# EAGLE design plat_40pinControlSimple (EAGLE 5.11)
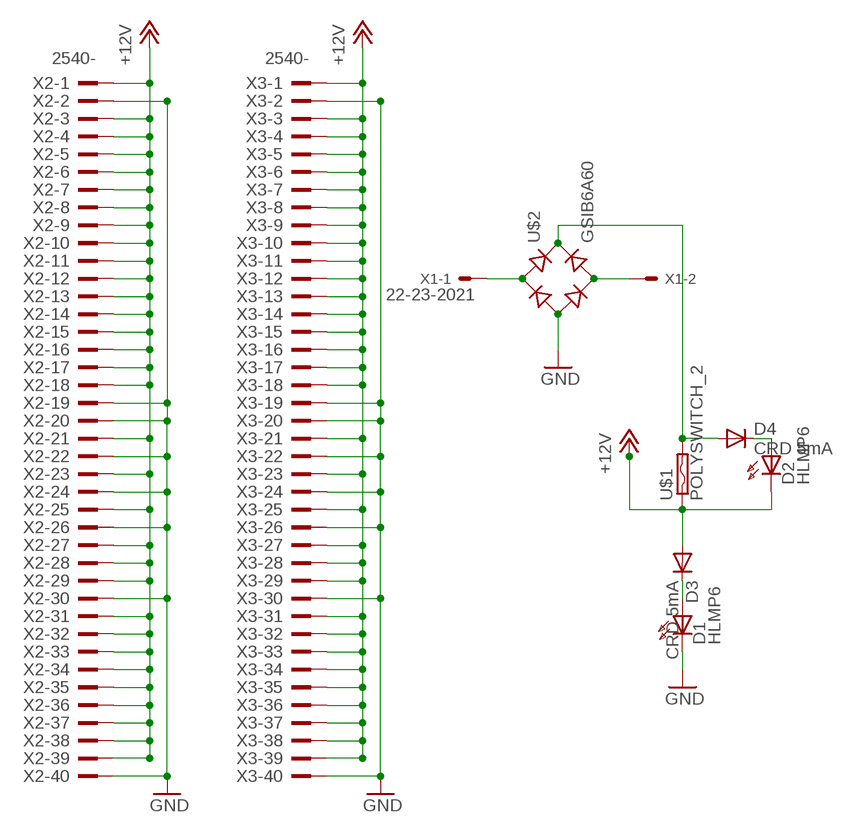
[diagram p0: schematic, sheet 1]

## Parts
D1  HLMP6  [HLMP6]
D2  HLMP6  [HLMP6]
D3  CRD 5mA  1N4148DO35-7  [DO35-7]
D4  CRD 5mA  1N4148DO35-7  [DO35-7]
U$1  POLYSWITCH_2  [0204/5]
U$2  GSIB6A60  [GSIB6A60]
X1  22-23-2021  [22-23-2021]
X2  2540-  [PAK100/2500-40]
X3  2540-  [PAK100/2500-40]

## Nets
+12V: D2.K D3.A U$1.1 X2.1 X2.3 X2.4 X2.5 X2.6 X2.7 X2.8 X2.9 X2.10 X2.11 X2.12 X2.13 X2.14 X2.15 X2.16 X2.17 X2.18 X2.21 X2.23 X2.25 X2.27 X2.28 X2.29 X2.31 X2.32 X2.33 X2.34 X2.35 X2.36 X2.37 X2.38 X2.39 X3.1 X3.3 X3.4 X3.5 X3.6 X3.7 X3.8 X3.9 X3.10 X3.11 X3.12 X3.13 X3.14 X3.15 X3.16 X3.17 X3.18 X3.21 X3.23 X3.25 X3.27 X3.28 X3.29 X3.31 X3.32 X3.33 X3.34 X3.35 X3.36 X3.37 X3.38 X3.39
GND: D1.K U$2.P$4.-(-) X2.2 X2.19 X2.20 X2.22 X2.24 X2.26 X2.30 X2.40 X3.2 X3.19 X3.20 X3.22 X3.24 X3.26 X3.30 X3.40
N$1: D1.A D3.C
N$2: U$2.P$2.AC1(AC1) X1.1
N$3: D2.A D4.C
N$4: U$2.P$3.AC2(AC2) X1.2
N$9: D4.A U$1.2 U$2.P$1.+(+)

## Library data of the parts
D1 D2 = display-hp:HLMP6: LED 2mm horizontal; MF: AGILENT TECHNOLOGIES; MPN: HLMP-6500; OC_FARNELL: 1652490; OC_NEWARK: 40K0088
D3 D4 = diode:1N4148: DIODE high speed (Philips)
U$1 = myparts:POLYSWITCH_2
U$2 = myparts:GSIB6A60
X1 = con-molex:22-23-2021: .100" (2.54mm) Center Header - 2 Pin; MF: MOLEX; MPN: 22-23-2021; OC_FARNELL: 1462926; OC_NEWARK: 25C3832
X2 X3 = con-3m:2540-: 3M (TM) Pak 100 4-Wall Header Source: 3M; OC_FARNELL: unknown; OC_NEWARK: unknown

## Net classes
0 default: width 1.524 mm, drill 1.524 mm, clearance 1.016 mm

## Board
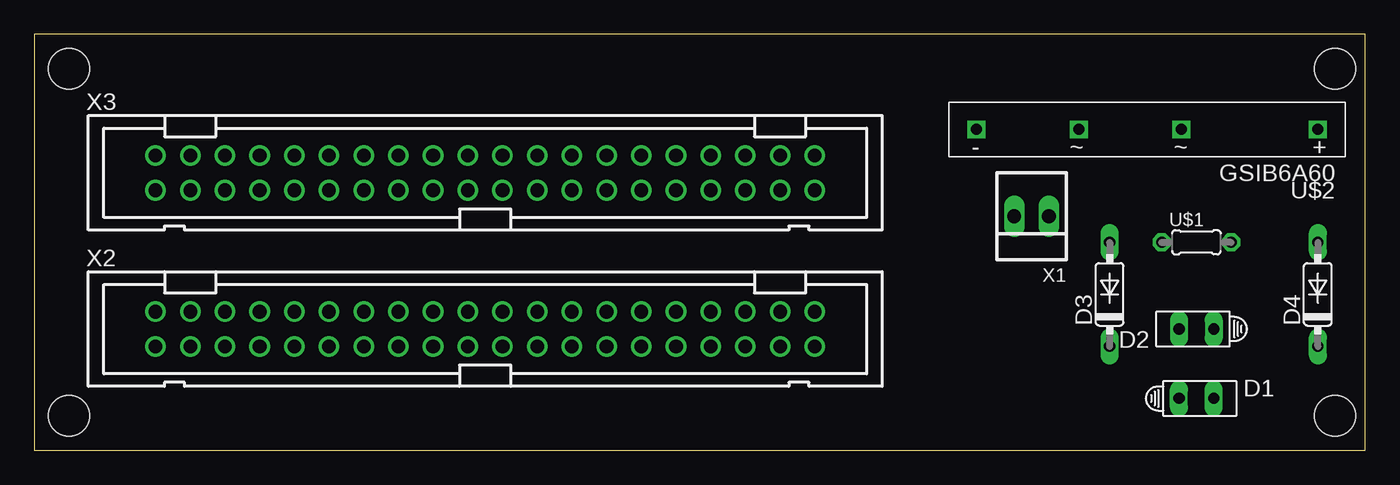
[diagram p1: board, top side]
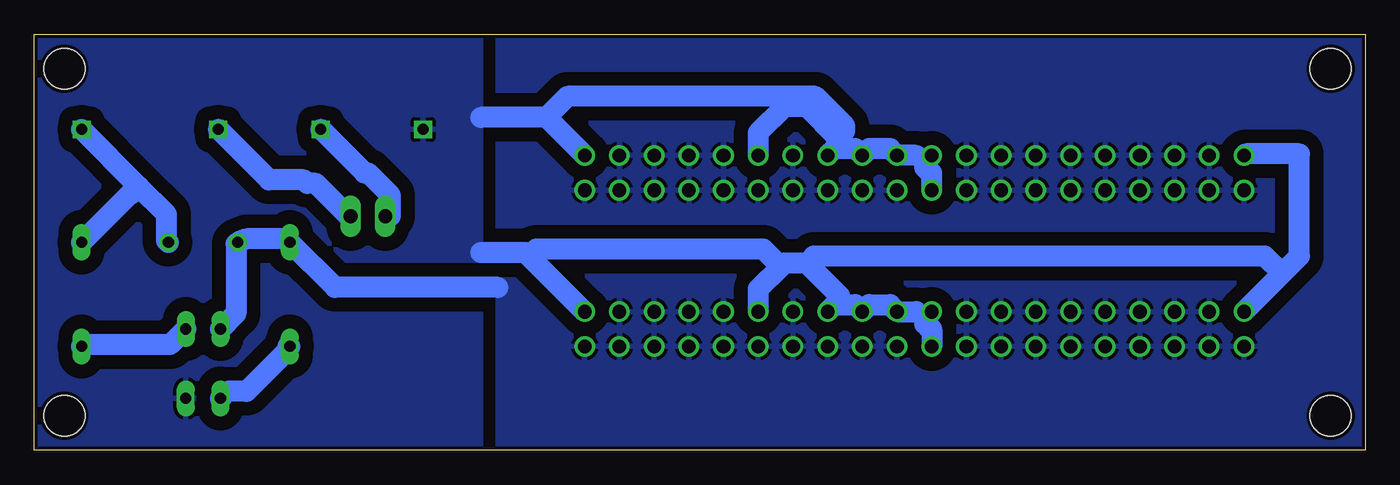
[diagram p2: board, bottom side, seen from below]

Size 97.46 x 30.47 mm. Coordinates in mm from the lower left corner, seen from the top.
Outline: 0,0 97.46,0 97.46,30.47 0,30.47 0,0
Copper layers (1*16): Top 0.035mm / dielectric 1.5mm / Bottom 0.035mm
Design rules "default *": minimum track width 10mil, minimum drill 24mil, track to track 13mil, track to pad 13mil, pad to pad 13mil, via to via 13mil, smd to smd 13mil, copper to edge 10mil, drill to drill 8mil, minimum pad ring 10mil, minimum via ring 8mil, stop-mask expansion 4mil, vias tented up to drill 0mil, thermal gap 10mil
Holes 3 mm at 2.54,27.94 2.54,2.54 95.25,27.94 95.25,2.54

### Footprints (pad centres in the part's own frame; a part is rotated, then mirrored left to right if it is on the bottom)
HLMP6 = drill 0.813 long: A -1.27,0; K 1.27,0
DO35-7 = drill 0.813 long: A 3.81,0; C -3.81,0
0204/5 = drill 0.813 octagon: 1 -2.54,0; 2 2.54,0
GSIB6A60 = drill 0.8 square: P$1.+ 0,0; P$2.AC1 10,0; P$3.AC2 17.5,0; P$4.- 25,0
22-23-2021 = drill 1 long: 1 -1.27,0; 2 1.27,0
PAK100/2500-40 = drill 1 pad 1.422 round: 1 -24.13,-1.27; 2 -24.13,1.27; 3 -21.59,-1.27; 4 -21.59,1.27; 5 -19.05,-1.27; 6 -19.05,1.27; 7 -16.51,-1.27; 8 -16.51,1.27; 9 -13.97,-1.27; 10 -13.97,1.27; 11 -11.43,-1.27; 12 -11.43,1.27; 13 -8.89,-1.27; 14 -8.89,1.27; 15 -6.35,-1.27; 16 -6.35,1.27; 17 -3.81,-1.27; 18 -3.81,1.27; 19 -1.27,-1.27; 20 -1.27,1.27; 21 1.27,-1.27; 22 1.27,1.27; 23 3.81,-1.27; 24 3.81,1.27; 25 6.35,-1.27; 26 6.35,1.27; 27 8.89,-1.27; 28 8.89,1.27; 29 11.43,-1.27; 30 11.43,1.27; 31 13.97,-1.27; 32 13.97,1.27; 33 16.51,-1.27; 34 16.51,1.27; 35 19.05,-1.27; 36 19.05,1.27; 37 21.59,-1.27; 38 21.59,1.27; 39 24.13,-1.27; 40 24.13,1.27

### Placement (x,y rotation side)
D1  85.09,3.81 0 top
D2  85.09,8.89 180 top
D3  78.74,11.43 90 top
D4  93.98,11.43 90 top
U$1  85.09,15.24 0 top
U$2  93.98,23.5 180 top
X1  73.03,17.14 180 top
X2  33.02,8.89 0 top
X3  33.02,20.32 0 top

### Tracks (layer width: path | path; a pad name or v marks a point on that pad's centre or on a via)
+12V
  Bottom 1.524: D2.K 82.68,10.03 82.68,15.11 U$1.1 81.92,15.49 78.99,15.49 D3.A 75.44,11.94 63.5,11.94
  pour Bottom: 0,30.48 0,0 63.5,0 63.5,30.48
GND
  Bottom 1.524: X3.19 31.75,20.32 31.88,20.32 32.26,20.7 32.26,21.21 | 32.26,21.21 32.13,21.21 X3.20 | 32.26,21.21 32.89,21.59 X3.22 34.8,22.1 36.32,22.1 X3.24 37.34,22.1 38.86,22.1 | 38.86,22.1 X3.26 | X3.30 44.45,23.24 42.55,25.15 40.89,25.15 38.61,22.86 | 38.61,22.86 38.48,22.73 38.86,22.1 | 61.21,14.22 61.47,14.48 64.77,14.48 | 61.21,14.22 X2.40 | 59.94,24.38 X3.40 | 59.94,24.38 64.77,24.38 | 38.61,22.86 38.1,23.37 38.1,23.75 40.26,25.91 58.42,25.91 59.94,24.38 | 6.1,12.95 4.83,14.22 4.83,21.72 8.76,21.72 X3.2 | 6.1,12.95 X2.2 | X2.19 31.75,8.89 31.88,8.89 32.26,9.27 32.26,9.78 | 32.26,9.78 32.13,9.78 X2.20 | 32.26,9.78 32.89,10.16 X2.22 34.8,10.67 36.32,10.67 X2.24 37.34,10.67 38.86,10.67 | 38.86,10.67 X2.26 | X2.30 44.45,11.81 42.8,13.46 | 42.8,13.46 42.55,13.72 40.89,13.72 | 40.89,13.72 38.48,11.3 38.86,10.67 | 6.1,12.95 7.37,14.22 40.39,14.22 40.89,13.72 | 61.21,14.22 60.71,14.73 44.07,14.73 42.8,13.46
  pour Bottom: 64.77,30.48 64.77,0 97.79,0 97.79,30.48
N$1
  Bottom 1.524: D1.A 83.31,4.32 81.92,4.32 78.87,7.37 78.87,7.62 D3.C
N$2
  Bottom 1.524: X1.1 74.42,17.14 76.83,19.56 77.47,19.56 77.72,19.81 80.26,19.81 83.95,23.5 U$2.P$2.AC1
N$3
  Bottom 1.524: D2.A 87.5,7.75 93.73,7.75 93.85,7.62 D4.C
N$4
  Bottom 1.524: X1.2 71.37,17.14 71.37,18.67 73.03,20.32 73.28,20.32 76.45,23.5 U$2.P$3.AC2
N$9
  Bottom 1.524: 89.79,19.3 87.76,17.27 87.76,15.37 U$1.2 | 89.79,19.3 U$2.P$1.+ | D4.A 90.42,18.8 90.3,18.8 89.79,19.3